# Altium project project2.PrjPcb
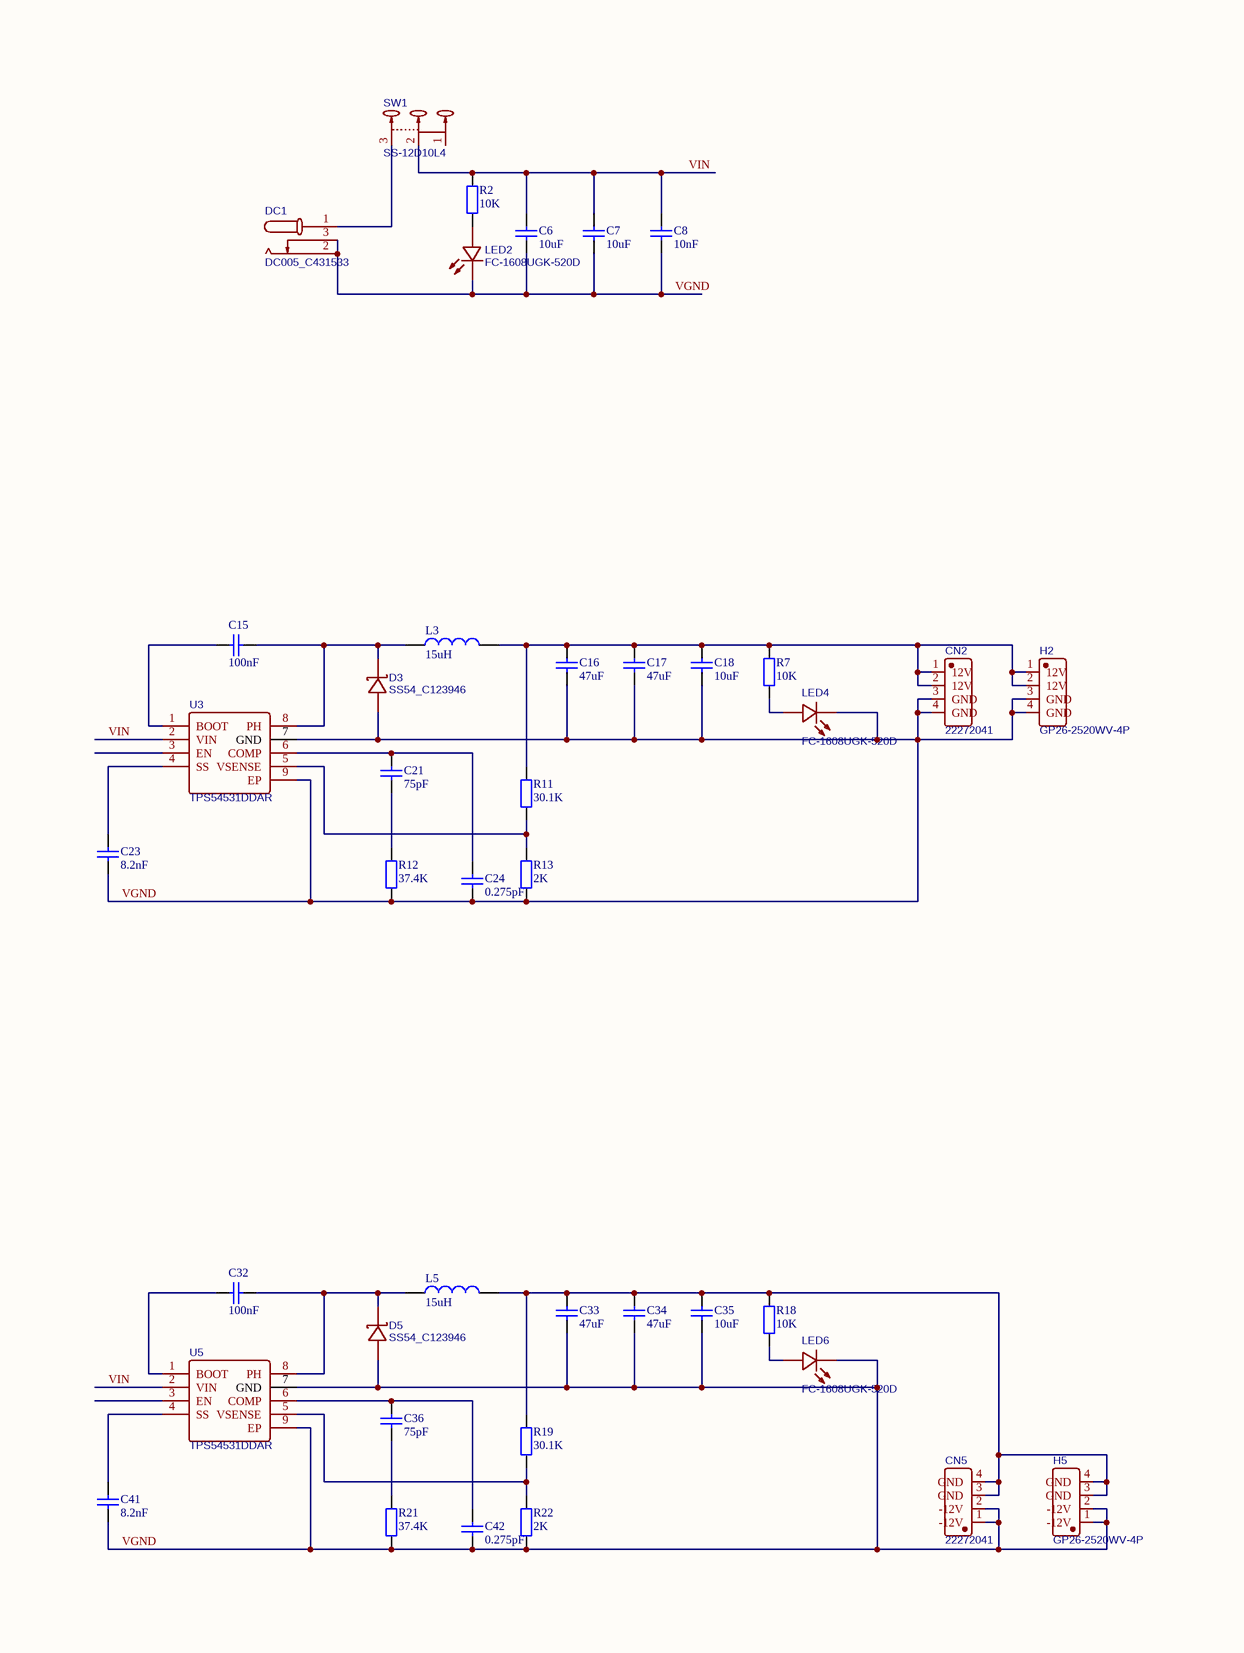
[diagram p0: Sheet2.SchDoc, left]
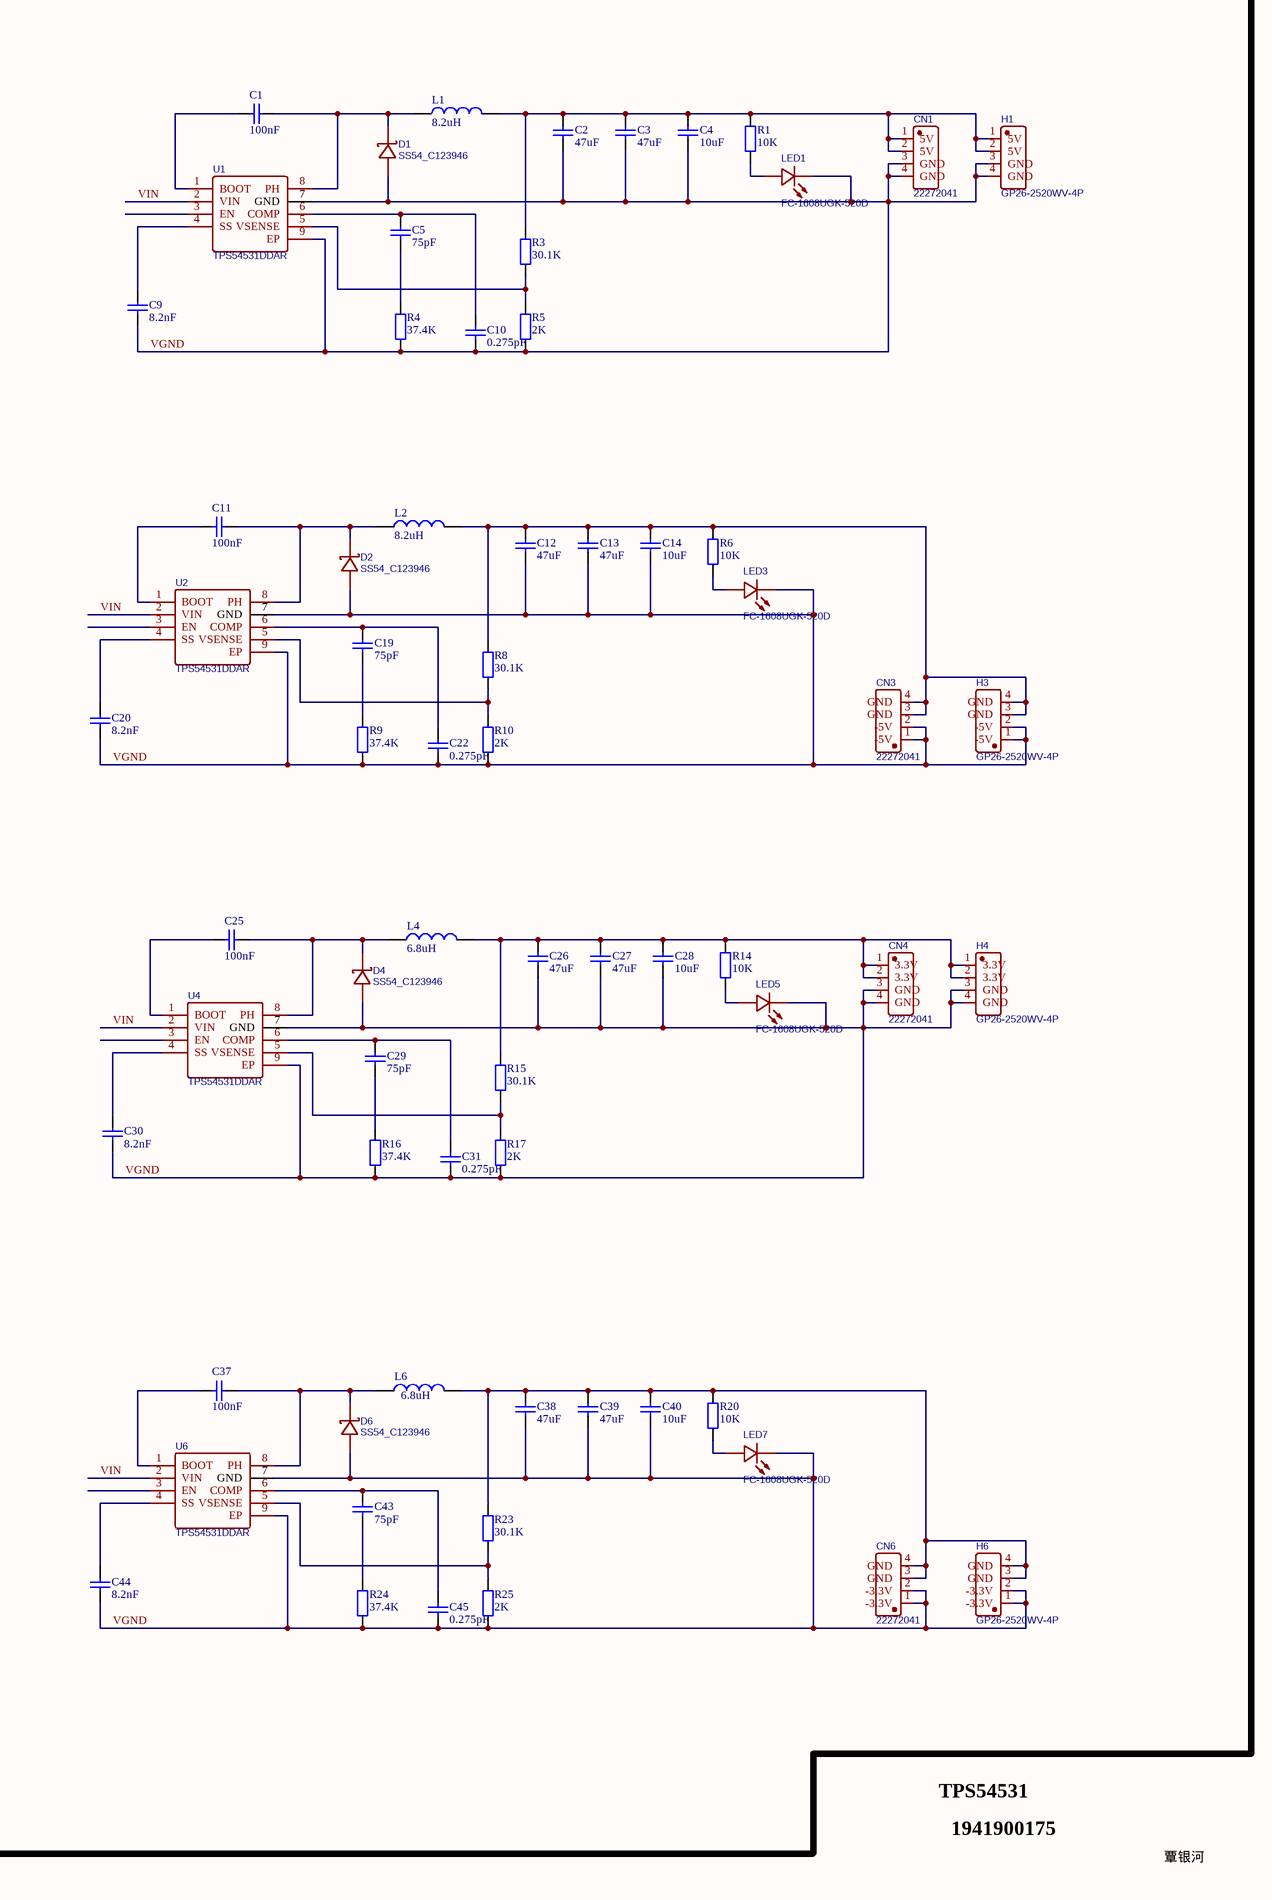
[diagram p1: Sheet2.SchDoc, right]
1 sheet, 109 parts. Net scope: global (net labels, ports and power ports of the same name join across sheets).
Board file: PCB2.PcbDoc

## Sheet Sheet2.SchDoc
size A2; SheetNumber: 1; SheetTotal: 1

### Parts
C1  100nF  [C0603_M]
C2  47uF  [C0603_M]
C3  47uF  [C0603_M]
C4  10uF  [C0603_M]
C5  75pF  [C0603_M]
C6  10uF  [C0603_M]
C7  10uF  [C0603_M]
C8  10nF  [C0603_M]
C9  8.2nF  [C0603_M]
C10  0.275pF  [C0603_M]
C11  100nF  [C0603_M]
C12  47uF  [C0603_M]
C13  47uF  [C0603_M]
C14  10uF  [C0603_M]
C15  100nF  [C0603_M]
C16  47uF  [C0603_M]
C17  47uF  [C0603_M]
C18  10uF  [C0603_M]
C19  75pF  [C0603_M]
C20  8.2nF  [C0603_M]
C21  75pF  [C0603_M]
C22  0.275pF  [C0603_M]
C23  8.2nF  [C0603_M]
C24  0.275pF  [C0603_M]
C25  100nF  [C0603_M]
C26  47uF  [C0603_M]
C27  47uF  [C0603_M]
C28  10uF  [C0603_M]
C29  75pF  [C0603_M]
C30  8.2nF  [C0603_M]
C31  0.275pF  [C0603_M]
C32  100nF  [C0603_M]
C33  47uF  [C0603_M]
C34  47uF  [C0603_M]
C35  10uF  [C0603_M]
C36  75pF  [C0603_M]
C37  100nF  [C0603_M]
C38  47uF  [C0603_M]
C39  47uF  [C0603_M]
C40  10uF  [C0603_M]
C41  8.2nF  [C0603_M]
C42  0.275pF  [C0603_M]
C43  75pF  [C0603_M]
C44  8.2nF  [C0603_M]
C45  0.275pF  [C0603_M]
CN1  22272041  [CONN-TH_22272041]
CN2  22272041  [CONN-TH_22272041]
CN3  22272041  [CONN-TH_22272041]
CN4  22272041  [CONN-TH_22272041]
CN5  22272041  [CONN-TH_22272041]
CN6  22272041  [CONN-TH_22272041]
D1  SS54_C123946  [SMA_L4.4-W2.8-LS5.4-RD]
D2  SS54_C123946  [SMA_L4.4-W2.8-LS5.4-RD]
D3  SS54_C123946  [SMA_L4.4-W2.8-LS5.4-RD]
D4  SS54_C123946  [SMA_L4.4-W2.8-LS5.4-RD]
D5  SS54_C123946  [SMA_L4.4-W2.8-LS5.4-RD]
D6  SS54_C123946  [SMA_L4.4-W2.8-LS5.4-RD]
DC1  DC005_C431533  [DC-IN-TH_DC005]
H1  GP26-2520WV-4P  [HDR-TH_4P-P2.54-V-F-R1-C4]
H2  GP26-2520WV-4P  [HDR-TH_4P-P2.54-V-F-R1-C4]
H3  GP26-2520WV-4P  [HDR-TH_4P-P2.54-V-F-R1-C4]
H4  GP26-2520WV-4P  [HDR-TH_4P-P2.54-V-F-R1-C4]
H5  GP26-2520WV-4P  [HDR-TH_4P-P2.54-V-F-R1-C4]
H6  GP26-2520WV-4P  [HDR-TH_4P-P2.54-V-F-R1-C4]
L1  8.2uH  [IND-SMD_L7.0-W6.6]
L2  8.2uH  [IND-SMD_L7.0-W6.6]
L3  15uH  [IND-SMD_L5.0-W5.0_SWPA5040S]
L4  6.8uH  [IND-SMD_L10.5-W10.3]
L5  15uH  [IND-SMD_L5.0-W5.0_SWPA5040S]
L6  6.8uH  [IND-SMD_L10.5-W10.3]
LED1  FC-1608UGK-520D  [LED0603-RD]
LED2  FC-1608UGK-520D  [LED0603-RD]
LED3  FC-1608UGK-520D  [LED0603-RD]
LED4  FC-1608UGK-520D  [LED0603-RD]
LED5  FC-1608UGK-520D  [LED0603-RD]
LED6  FC-1608UGK-520D  [LED0603-RD]
LED7  FC-1608UGK-520D  [LED0603-RD]
R1  10K  [R0603_M]
R2  10K  [R0603_M]
R3  30.1K  [R0603_M]
R4  37.4K  [R0603_M]
R5  2K  [R0603_M]
R6  10K  [R0603_M]
R7  10K  [R0603_M]
R8  30.1K  [R0603_M]
R9  37.4K  [R0603_M]
R10  2K  [R0603_M]
R11  30.1K  [R0603_M]
R12  37.4K  [R0603_M]
R13  2K  [R0603_M]
R14  10K  [R0603_M]
R15  30.1K  [R0603_M]
R16  37.4K  [R0603_M]
R17  2K  [R0603_M]
R18  10K  [R0603_M]
R19  30.1K  [R0603_M]
R20  10K  [R0603_M]
R21  37.4K  [R0603_M]
R22  2K  [R0603_M]
R23  30.1K  [R0603_M]
R24  37.4K  [R0603_M]
R25  2K  [R0603_M]
SW1  SS-12D10L4  [SW-TH_SS-12D10L3]
U1  TPS54531DDAR  [SOIC-8_L5.0-W4.0-P1.27-LS6.0-BL-EP]
U2  TPS54531DDAR  [SOIC-8_L5.0-W4.0-P1.27-LS6.0-BL-EP]
U3  TPS54531DDAR  [SOIC-8_L5.0-W4.0-P1.27-LS6.0-BL-EP]
U4  TPS54531DDAR  [SOIC-8_L5.0-W4.0-P1.27-LS6.0-BL-EP]
U5  TPS54531DDAR  [SOIC-8_L5.0-W4.0-P1.27-LS6.0-BL-EP]
U6  TPS54531DDAR  [SOIC-8_L5.0-W4.0-P1.27-LS6.0-BL-EP]

### Nets
VGND: C2.1 C3.1 C4.1 C6.1 C7.1 C8.1 C9.1 C10.1 C12.1 C13.1 C14.1 C16.1 C17.1 C18.1 C20.1 C22.1 C23.1 C24.1 C26.1 C27.1 C28.1 C30.1 C31.1 C33.1 C34.1 C35.1 C38.1 C39.1 C40.1 C41.1 C42.1 C44.1 C45.1 CN1.3(GND) CN1.4(GND) CN2.3(GND) CN2.4(GND) CN3.1(-5V) CN3.2(-5V) CN4.3(GND) CN4.4(GND) CN5.1(-12V) CN5.2(-12V) CN6.1(-3.3V) CN6.2(-3.3V) D1.2(A) D2.2(A) D3.2(A) D4.2(A) D5.2(A) D6.2(A) DC1.2 DC1.3 H1.3(GND) H1.4(GND) H2.3(GND) H2.4(GND) H3.1(-5V) H3.2(-5V) H4.3(GND) H4.4(GND) H5.1(-12V) H5.2(-12V) H6.1(-3.3V) H6.2(-3.3V) LED1.1(K) LED2.1(K) LED3.1(K) LED4.1(K) LED5.1(K) LED6.1(K) LED7.1(K) R4.1 R5.1 R9.1 R10.1 R12.1 R13.1 R16.1 R17.1 R21.1 R22.1 R24.1 R25.1 U1.7(GND) U1.9(EP) U2.7(GND) U2.9(EP) U3.7(GND) U3.9(EP) U4.7(GND) U4.9(EP) U5.7(GND) U5.9(EP) U6.7(GND) U6.9(EP)
VIN: C6.2 C7.2 C8.2 R2.2 SW1.2 U1.2(VIN) U2.2(VIN) U3.2(VIN) U4.2(VIN) U5.2(VIN) U6.2(VIN)
NetC1_1: C1.1 U1.1(BOOT)
NetC1_2: C1.2 D1.1(K) L1.1 U1.8(PH)
NetC2_2: C2.2 C3.2 C4.2 CN1.1(5V) CN1.2(5V) H1.1(5V) H1.2(5V) L1.2 R1.2 R3.2
NetC5_1: C5.1 R4.2
NetC5_2: C5.2 C10.2 U1.6(COMP)
NetC9_2: C9.2 U1.4(SS)
NetC11_1: C11.1 U2.1(BOOT)
NetC11_2: C11.2 D2.1(K) L2.1 U2.8(PH)
NetC12_2: C12.2 C13.2 C14.2 CN3.3(GND) CN3.4(GND) H3.3(GND) H3.4(GND) L2.2 R6.2 R8.2
NetC15_1: C15.1 U3.1(BOOT)
NetC15_2: C15.2 D3.1(K) L3.1 U3.8(PH)
NetC16_2: C16.2 C17.2 C18.2 CN2.1(12V) CN2.2(12V) H2.1(12V) H2.2(12V) L3.2 R7.2 R11.2
NetC19_1: C19.1 R9.2
NetC19_2: C19.2 C22.2 U2.6(COMP)
NetC20_2: C20.2 U2.4(SS)
NetC21_1: C21.1 R12.2
NetC21_2: C21.2 C24.2 U3.6(COMP)
NetC23_2: C23.2 U3.4(SS)
NetC25_1: C25.1 U4.1(BOOT)
NetC25_2: C25.2 D4.1(K) L4.1 U4.8(PH)
NetC26_2: C26.2 C27.2 C28.2 CN4.1(3.3V) CN4.2(3.3V) H4.1(3.3V) H4.2(3.3V) L4.2 R14.2 R15.2
NetC29_1: C29.1 R16.2
NetC29_2: C29.2 C31.2 U4.6(COMP)
NetC30_2: C30.2 U4.4(SS)
NetC32_1: C32.1 U5.1(BOOT)
NetC32_2: C32.2 D5.1(K) L5.1 U5.8(PH)
NetC33_2: C33.2 C34.2 C35.2 CN5.3(GND) CN5.4(GND) H5.3(GND) H5.4(GND) L5.2 R18.2 R19.2
NetC36_1: C36.1 R21.2
NetC36_2: C36.2 C42.2 U5.6(COMP)
NetC37_1: C37.1 U6.1(BOOT)
NetC37_2: C37.2 D6.1(K) L6.1 U6.8(PH)
NetC38_2: C38.2 C39.2 C40.2 CN6.3(GND) CN6.4(GND) H6.3(GND) H6.4(GND) L6.2 R20.2 R23.2
NetC41_2: C41.2 U5.4(SS)
NetC43_1: C43.1 R24.2
NetC43_2: C43.2 C45.2 U6.6(COMP)
NetC44_2: C44.2 U6.4(SS)
NetDC1_1: DC1.1 SW1.3
NetLED1_2: LED1.2(A) R1.1
NetLED2_2: LED2.2(A) R2.1
NetLED3_2: LED3.2(A) R6.1
NetLED4_2: LED4.2(A) R7.1
NetLED5_2: LED5.2(A) R14.1
NetLED6_2: LED6.2(A) R18.1
NetLED7_2: LED7.2(A) R20.1
NetR3_1: R3.1 R5.2 U1.5(VSENSE)
NetR8_1: R8.1 R10.2 U2.5(VSENSE)
NetR11_1: R11.1 R13.2 U3.5(VSENSE)
NetR15_1: R15.1 R17.2 U4.5(VSENSE)
NetR19_1: R19.1 R22.2 U5.5(VSENSE)
NetR23_1: R23.1 R25.2 U6.5(VSENSE)

Not connected (* = marked no-connect by the designer): SW1 1; U1 3(EN); U2 3(EN); U3 3(EN); U4 3(EN); U5 3(EN); U6 3(EN)

### Notes on the sheet
- TPS54531
- 1941900175
- 覃银河

### Library data of the parts
C1-C45 = C: 贴片电容; BOM名称: 无极性贴片电容; 联系卖家，免费查找封装: 唯一出售店铺网址https://shop463601444.taobao.com
CN1-CN6 = 22272041: BOM_Manufacturer: MOLEX; Contributor: LCSC; BOM_Supplier: LCSC; BOM_Supplier Part: C504991; BOM_Manufacturer Part: 22272041; BOM_JLCPCB Part Class: Extended Part; JLCPCB Part Class: Extended Part; spicePre: C; spiceSymbolName: 22272041
D1-D6 = SS54_C123946: BOM_Manufacturer: Jingdao; BOM_Manufacturer Part: SS54; Contributor: LCSC; BOM_Supplier: LCSC; BOM_Supplier Part: C123946; BOM_JLCPCB Part Class: Extended Part; JLCPCB Part Class: Extended Part; spicePre: D; spiceSymbolName: SS54_C123946
DC1 = DC005_C431533: BOM_Manufacturer: SHOU HAN; BOM_Manufacturer Part: DC005; Contributor: LCSC; BOM_Supplier: LCSC; BOM_Supplier Part: C431533; JLCPCB Part Class: Extended Part; spicePre: D; spiceSymbolName: DC005_C431533
H1-H6 = GP26-2520WV-4P: BOM_Manufacturer: GEPU(歌普); Contributor: LCSC; BOM_Supplier: LCSC; BOM_Supplier Part: C2681739; BOM_Manufacturer Part: GP26-2520WV-4P; JLCPCB Part Class: Extended Part; spicePre: H; spiceSymbolName: GP26-2520WV-4P
L1-L6 = L-AL: 色环电感; 联系卖家，免费查找封装: 唯一出售店铺网址https://shop463601444.taobao.com; 封装库来自淘宝卖家ID：黄晶宝石: 其他店铺购入均为盗版假冒封装库，请立即申请退款; BOM名称: 色环电感
LED1-LED7 = FC-1608UGK-520D: BOM_Manufacturer: NATIONSTAR; BOM_Supplier: LCSC; BOM_Manufacturer Part: FC-1608UGK-520D; BOM_Supplier Part: C87326; spicePre: L; spiceSymbolName: FC-1608UGK-520D
R1-R25 = R: 贴片电阻; 联系卖家，免费查找封装: 唯一出售店铺网址https://shop463601444.taobao.com; 封装库来自淘宝卖家ID：黄晶宝石: 其他店铺购入均为盗版假冒封装库，请立即申请退款; BOM名称: 贴片电阻
SW1 = SS-12D10L4: BOM_Manufacturer: XKB Connectivity; Contributor: LCSC; BOM_Supplier: LCSC; BOM_Supplier Part: C843364; BOM_Manufacturer Part: SS-12D10L4; JLCPCB Part Class: Extended Part; spicePre: S; spiceSymbolName: SS-12D10L4
U1-U6 = TPS54531DDAR: BOM_Manufacturer: TI; BOM_Supplier: LCSC; BOM_Manufacturer Part: TPS54531DDAR; BOM_Supplier Part: C50605; BOM_JLCPCB Part Class: Extended Part; JLCPCB Part Class: Extended Part; spicePre: U; spiceSymbolName: TPS54531DDAR